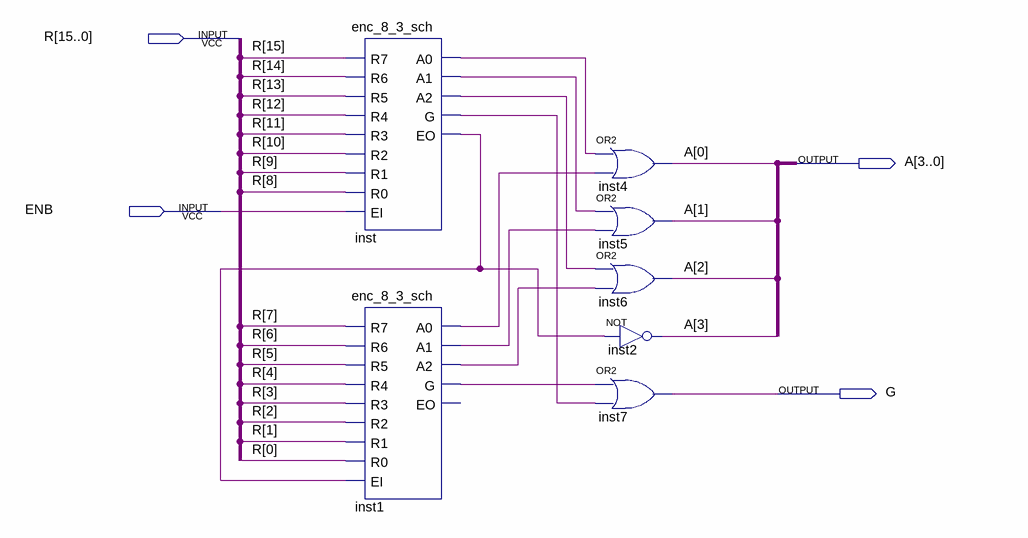
[diagram p0: schematic sheet]
// Quartus schematic enc_16_4_sch.bdf as structural Verilog: 7 symbols, 4 pins
module enc_16_4_sch (
  input  [15:0] R,
  input  ENB,
  output [3:0] A,
  output G
);

  wire inst1_a0, inst1_a1, inst1_a2, inst1_g, inst_a0, inst_a1, inst_a2, inst_eo, inst_g;

  enc_8_3_sch inst (
    .R7(R[15]), .R6(R[14]), .R5(R[13]), .R4(R[12]), .R3(R[11]), .R2(R[10]), .R1(R[9]), .R0(R[8]), .EI(ENB),
    .A0(inst_a0), .A1(inst_a1), .A2(inst_a2), .G(inst_g), .EO(inst_eo));
  enc_8_3_sch inst1 (
    .R7(R[7]), .R6(R[6]), .R5(R[5]), .R4(R[4]), .R3(R[3]), .R2(R[2]), .R1(R[1]), .R0(R[0]), .EI(inst_eo),
    .A0(inst1_a0), .A1(inst1_a1), .A2(inst1_a2), .G(inst1_g));  // open: EO
  or inst4 (A[0], inst_a0, inst1_a0);
  or inst5 (A[1], inst_a1, inst1_a1);
  or inst6 (A[2], inst_a2, inst1_a2);
  not inst2 (A[3], inst_eo);
  or inst7 (G, inst1_g, inst_g);
endmodule
